# EAGLE design trans (EAGLE 6.6.0)
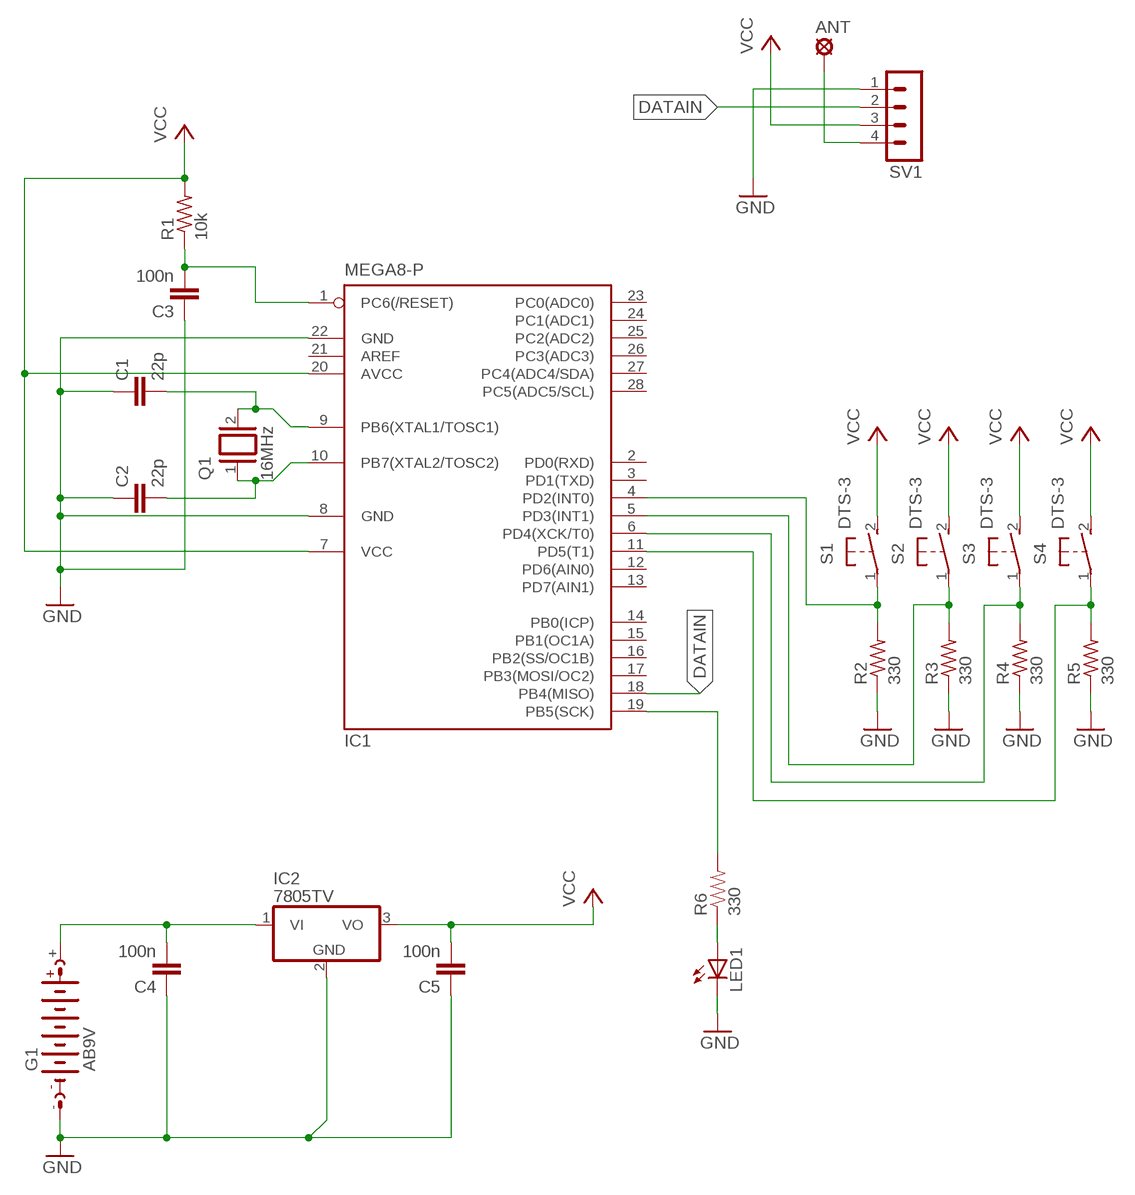
[diagram p0: schematic, sheet 1]

## Parts
ANT  LSP10  [LSP10]
C1  22p  C-EU025-024X044  [C025-024X044]
C2  22p  C-EU025-024X044  [C025-024X044]
C3  100n  C-EU025-024X044  [C025-024X044]
C4  100n  C-EU025-024X044  [C025-024X044]
C5  100n  C-EU025-024X044  [C025-024X044]
G1  AB9V  [AB9V]
IC1  MEGA8-P  [DIL28-3]
IC2  7805TV  [TO220V]
LED1  LED5MM  [LED5MM]
Q1  16MHz  XTAL/S  [QS]
R1  10k  R-US_0204/2V  [0204V]
R2  330  R-US_0204/2V  [0204V]
R3  330  R-US_0204/2V  [0204V]
R4  330  R-US_0204/2V  [0204V]
R5  330  R-US_0204/2V  [0204V]
R6  330  RESISTORPTH-1/4W  [AXIAL-0.4]
S1  DTS-3  [DTS-3]
S2  DTS-3  [DTS-3]
S3  DTS-3  [DTS-3]
S4  DTS-3  [DTS-3]
SV1  MA04-1  [MA04-1]

## Nets
DATAIN: IC1.18(PB4(MISO)) SV1.2
GND: C1.1 C2.1 C3.1 C4.1 C5.1 G1.- IC1.8(GND) IC1.22(GND) IC2.2(GND) LED1.K(C) R2.1 R3.1 R4.1 R5.1 SV1.1
N$1: C1.2 IC1.9(PB6(XTAL1/TOSC1)) Q1.2
N$2: C2.2 IC1.10(PB7(XTAL2/TOSC2)) Q1.1
N$3: C3.2 IC1.1(PC6(/RESET)) R1.1
N$4: ANT.MP SV1.4
N$5: C4.2 G1.+ IC2.1(VI)
N$6: IC1.4(PD2(INT0)) R2.2 S1.1
N$7: IC1.5(PD3(INT1)) R3.2 S2.1
N$8: IC1.19(PB5(SCK)) R6.P$2
N$9: IC1.11(PD5(T1)) R5.2 S4.1
N$10: IC1.6(PD4(XCK/T0)) R4.2 S3.1
N$12: LED1.A R6.P$1
VCC: C5.2 IC1.7(VCC) IC1.20(AVCC) IC2.3(VO) R1.2 S1.2 S2.2 S3.2 S4.2 SV1.3
Unconnected: IC1.2(PD0(RXD)) IC1.3(PD1(TXD)) IC1.12(PD6(AIN0)) IC1.13(PD7(AIN1)) IC1.14(PB0(ICP)) IC1.15(PB1(OC1A)) IC1.16(PB2(SS/OC1B)) IC1.17(PB3(MOSI/OC2)) IC1.21(AREF) IC1.23(PC0(ADC0)) IC1.24(PC1(ADC1)) IC1.25(PC2(ADC2)) IC1.26(PC3(ADC3)) IC1.27(PC4(ADC4/SDA)) IC1.28(PC5(ADC5/SCL))

## Library data of the parts
ANT = solpad:LSP10: SOLDER PAD drill 1.0 mm, distributor Buerklin, 12H555
C1-C5 = resistor:C-EU: CAPACITOR, European symbol
G1 = battery:AB9V: 9-V BATTERY CLIP
IC1 = atmel:MEGA8-P: MICROCONTROLLER 8 Kbytes FLASH, 1 kbytes SRAM, 512 bytes EEPROM, USART, 4-channel 10 bit ADC, 2-channel 8 bit ADC Pin compatible with Atmega48, ATMega88, ATMega168 Source: avr.lbr; OC_FARNELL: unknown; OC_NEWARK: unknown
IC2 = linear:78*: Positive VOLTAGE REGULATOR Source: http://cache.national.com/ds/LM/LM78L05.pdf http://www.fairchildsemi.com/ds/LM/LM7805.pdf
LED1 = led:LED: LED OSRAM: - CHIPLED LG R971, LG N971, LY N971, LG Q971, LY Q971, LO R971, LY R971 LH N974, LH R974 LS Q976, LO Q976, LY Q976 LO Q996 - Hyper CHIPLED LW Q18S LB Q993, LB Q99A, LB R99A - SideLED LS A670, LO A670, LY A670, LG A670, LP A670 LB A673, LV A673, LT A673, LW A673 LH A674 LY A675 LS A676, LA A676, LO A676, LY A676, LW A676 LS A679, LY A679, LG A679 - Hyper Micro SIDELED® LS Y876, LA Y876, LO Y876, LY Y876 LT Y87S - SmartLED LW L88C, LW L88S LB L89C, LB L89S, LG L890 LS L89K, LO L89K, LY L89K LS L896, LA L896, LO L896, LY L896 - TOPLED LS T670, LO T670, LY T670, LG T670, LP T670 LSG T670, LSP T670, LSY T670, LOP T670, LYG T670 LG T671, LOG T671, LSG T671 LB T673, LV T673, LT T673, LW T673 LH T674 LS T676, LA T676, LO T676, LY T676, LB T676, LH T676, LSB T676, LW T676 LB T67C, LV T67C, LT T67C, LS T67K, LO T67K, LY T67K, LW E67C LS E67B, LA E67B, LO E67B, LY E67B, LB E67C, LV E67C, LT E67C LW T67C LS T679, LY T679, LG T679 LS T770, LO T770, LY T770, LG T770, LP T770 LB T773, LV T773, LT T773, LW T773 LH T774 LS E675, LA E675, LY E675, LS T675 LS T776, LA T776, LO T776, LY T776, LB T776 LHGB T686 LT T68C, LB T68C - Hyper Mini TOPLED® LB M676 - Mini TOPLED Santana® LG M470 LS M47K, LO M47K, LY M47K Source: http://www.osram.convergy.de LUXEON: - LUMILED® LXK2-PW12-R00, LXK2-PW12-S00, LXK2-PW14-U00, LXK2-PW14-V00 LXK2-PM12-R00, LXK2-PM12-S00, LXK2-PM14-U00 LXK2-PE12-Q00, LXK2-PE12-R00, LXK2-PE12-S00, LXK2-PE14-T00, LXK2-PE14-U00 LXK2-PB12-K00, LXK2-PB12-L00, LXK2-PB12-M00, LXK2-PB14-N00, LXK2-PB14-P00, LXK2-PB14-Q00 LXK2-PR12-L00, LXK2-PR12-M00, LXK2-PR14-Q00, LXK2-PR14-R00 LXK2-PD12-Q00, LXK2-PD12-R00, LXK2-PD12-S00 LXK2-PH12-R00, LXK2-PH12-S00 LXK2-PL12-P00, LXK2-PL12-Q00, LXK2-PL12-R00 Source: www.luxeon.com KINGBRIGHT: KA-3528ASYC Source: www.kingbright.com
Q1 = special:XTAL/S: CRYSTAL
R1-R5 = rcl:R-US_: RESISTOR, American symbol
R6 = SparkFun:RESISTOR: Resistor Basic schematic elements and footprints for 0603, 1206, and PTH resistors.
S1-S4 = switch-tact:DTS-3
SV1 = con-lstb:MA04-1: PIN HEADER; OC_FARNELL: unknown; OC_NEWARK: unknown

## Board
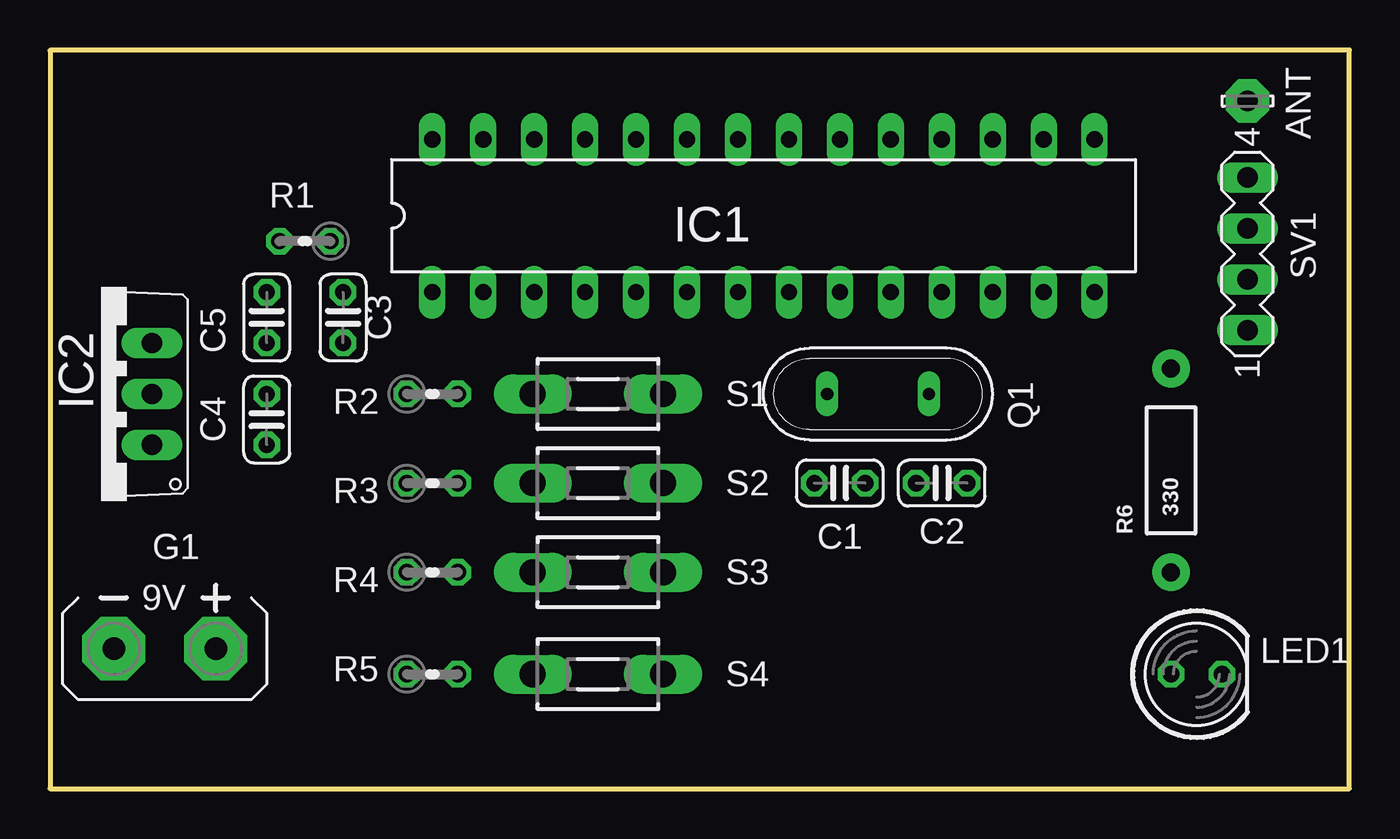
[diagram p1: board, top side]
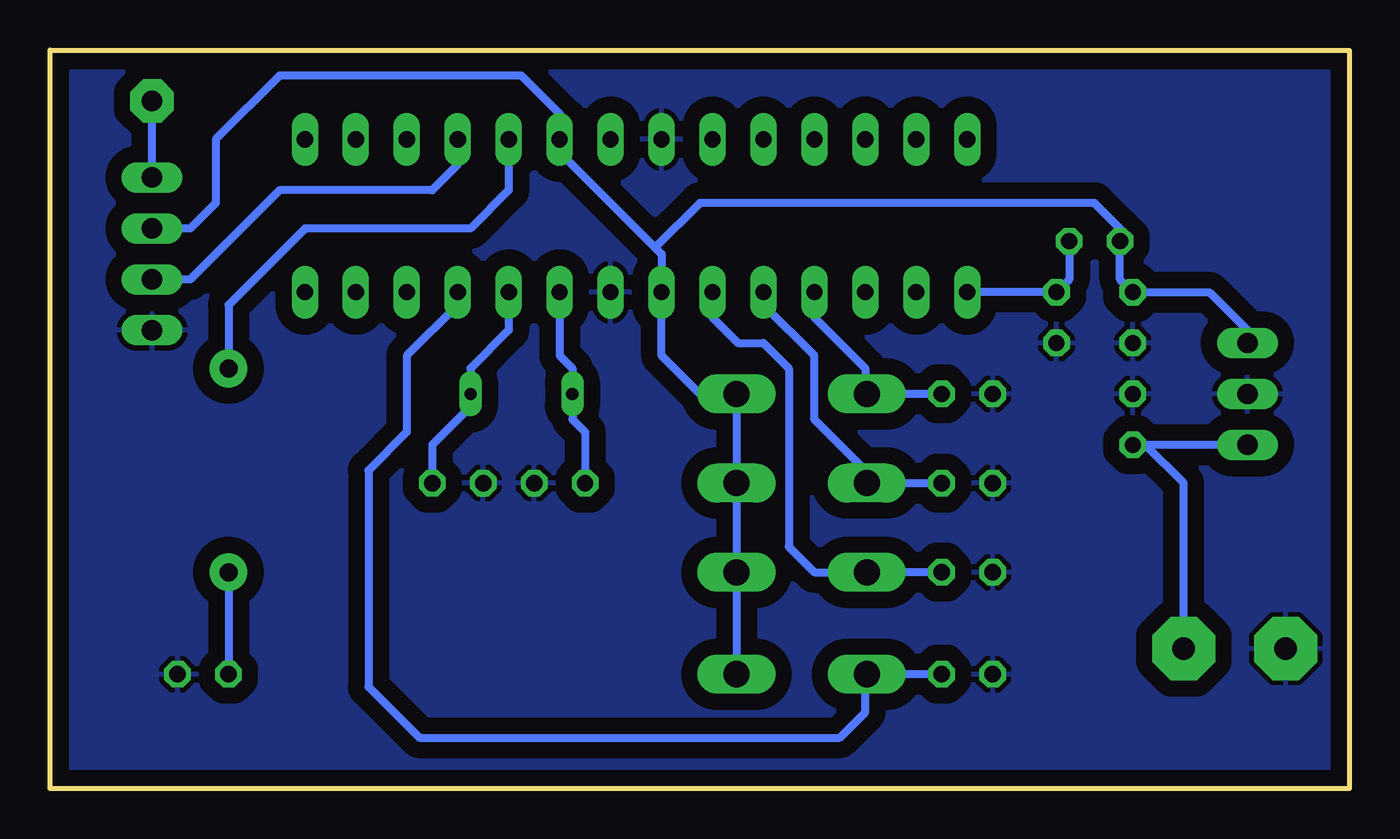
[diagram p2: board, bottom side, seen from below]

Size 64.77 x 36.83 mm. Coordinates in mm from the lower left corner, seen from the top.
Outline: 0,0 64.77,0 64.77,36.83 0,36.82 0,0
Copper layers (1*16): Top 0.035mm / dielectric 1.5mm / Bottom 0.035mm
Design rules "default *": minimum track width 10mil, minimum drill 24mil, track to track 12mil, track to pad 12mil, pad to pad 12mil, via to via 12mil, smd to smd 12mil, copper to edge 10mil, drill to drill 8mil, minimum pad ring 10mil, minimum via ring 8mil, stop-mask expansion 4mil, vias tented up to drill 0mil, thermal gap 10mil

### Footprints (pad centres in the part's own frame; a part is rotated, then mirrored left to right if it is on the bottom)
LSP10 = drill 1.016 pad 2.159 octagon: MP 0,0
C025-024X044 = drill 0.813 octagon: 1 -1.27,0; 2 1.27,0
AB9V = drill 1.118 pad 3.15 octagon: + 0,2.54; - 0,-2.54
DIL28-3 = drill 0.813 long: 1 -16.51,-3.81; 2 -13.97,-3.81; 3 -11.43,-3.81; 4 -8.89,-3.81; 5 -6.35,-3.81; 6 -3.81,-3.81; 7 -1.27,-3.81; 8 1.27,-3.81; 9 3.81,-3.81; 10 6.35,-3.81; 11 8.89,-3.81; 12 11.43,-3.81; 13 13.97,-3.81; 14 16.51,-3.81; 15 16.51,3.81; 16 13.97,3.81; 17 11.43,3.81; 18 8.89,3.81; 19 6.35,3.81; 20 3.81,3.81; 21 1.27,3.81; 22 -1.27,3.81; 23 -3.81,3.81; 24 -6.35,3.81; 25 -8.89,3.81; 26 -11.43,3.81; 27 -13.97,3.81; 28 -16.51,3.81
TO220V = drill 1.016 long: 1 -2.54,-2.54; 2 0,-2.54; 3 2.54,-2.54
LED5MM = drill 0.813 octagon: A -1.27,0; K 1.27,0
QS = drill 0.61 long: 1 -2.54,0; 2 2.54,0
0204V = drill 0.813 octagon: 1 -1.27,0; 2 1.27,0
AXIAL-0.4 = drill 0.9 pad 1.88: P$1 -5.08,0; P$2 5.08,0
DTS-3 = drill 1.3 long: 1 -3.25,0; 2 3.25,0
MA04-1 = drill 1.016 long: 1 -3.81,0; 2 -1.27,0; 3 1.27,0; 4 3.81,0

### Placement (x,y rotation side)
ANT  59.69,34.29 0 top
C1  39.37,15.24 180 top
C2  44.45,15.24 0 top
C3  14.61,23.5 90 top
C4  10.79,18.41 270 top
C5  10.79,23.5 90 top
G1  5.71,6.99 270 top
IC1  35.56,28.57 0 top
IC2  2.54,19.68 90 top
LED1  57.15,5.71 0 top
Q1  41.27,19.68 180 top
R1  12.7,27.3 180 top
R2  19.05,19.68 0 top
R3  19.05,15.24 0 top
R4  19.05,10.79 0 top
R5  19.05,5.71 0 top
R6  55.88,15.88 90 top
S1  27.3,19.68 0 top
S2  27.3,15.24 0 top
S3  27.3,10.79 0 top
S4  27.3,5.71 0 top
SV1  59.69,26.67 90 top

### Tracks (layer width: path | path; a pad name or v marks a point on that pad's centre or on a via)
DATAIN
  Bottom 0.406: IC1.18 44.45,31.11 45.72,29.84 53.34,29.84 57.78,25.4 SV1.2
GND
  pour Bottom (isolate 0.813): 0,36.2 64.77,36.2 64.77,0 0,0
N$1
  Bottom 0.406: IC1.9 39.37,21.59 38.73,20.95 Q1.2 38.73,18.41 38.1,17.78 C1.2
N$2
  Bottom 0.406: IC1.10 41.91,22.86 43.81,20.95 Q1.1 43.81,19.05 45.72,17.14 C2.2
N$3
  Bottom 0.406: R1.1 13.97,25.4 C3.2 IC1.1
N$4
  Bottom 0.406: SV1.4 ANT.MP
N$5
  Bottom 0.406: IC2.1 10.16,17.14 | 10.16,17.14 C4.2 | G1.+ 8.26,15.24 10.16,17.14
N$6
  Bottom 0.406: IC1.4 26.67,23.5 24.13,20.95 24.13,19.76 S1.1 R2.2
N$7
  Bottom 0.406: R3.2 S2.1 24.05,15.8 26.67,18.41 26.67,21.59 29.21,24.13 IC1.5
N$8
  Bottom 0.406: IC1.19 41.91,29.84 43.81,27.94 52.07,27.94 55.88,24.13 R6.P$2
N$9
  Bottom 0.406: IC1.11 44.45,24.13 46.99,21.59 46.99,17.78 48.9,15.88 48.9,5.08 46.35,2.54 25.4,2.54 24.13,3.81 24.13,5.64 S4.1 R5.2
N$10
  Bottom 0.406: R4.2 S3.1 26.67,10.79 27.94,12.06 27.94,20.95 29.21,22.23 30.48,22.23 31.75,23.5 IC1.6
N$12
  Bottom 0.406: R6.P$1 LED1.A
VCC
  Bottom 0.406: S4.2 S3.2 S2.2 S1.2 32.38,19.68 34.29,21.59 IC1.7 34.29,26.67 34.61,26.99 | IC2.3 5.08,22.86 6.99,24.77 C5.2 11.43,25.4 R1.2 11.43,27.94 12.7,29.21 32.38,29.21 34.61,26.99 | 34.61,26.99 39.37,31.75 IC1.20 39.37,33.66 41.27,35.56 53.34,35.56 56.52,32.38 56.52,29.21 57.78,27.94 SV1.3